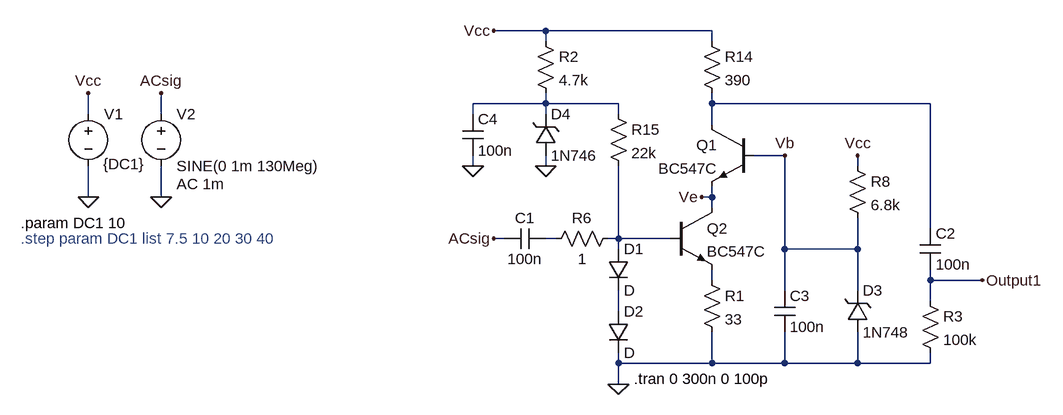
[diagram p0: schematic Cascode.asc]
Cascode.asc, the LTspice schematic file:
Version 4
SHEET 1 1248 680
WIRE -608 -576 -688 -576
WIRE -352 -576 -608 -576
WIRE -608 -560 -608 -576
WIRE -352 -560 -352 -576
WIRE -608 -464 -608 -480
WIRE -608 -464 -720 -464
WIRE -496 -464 -608 -464
WIRE -352 -464 -352 -480
WIRE -16 -464 -352 -464
WIRE -1312 -448 -1312 -480
WIRE -1200 -448 -1200 -480
WIRE -720 -448 -720 -464
WIRE -608 -448 -608 -464
WIRE -496 -448 -496 -464
WIRE -352 -432 -352 -464
WIRE -240 -384 -288 -384
WIRE -720 -368 -720 -384
WIRE -608 -368 -608 -384
WIRE -128 -368 -128 -384
WIRE -1312 -320 -1312 -368
WIRE -1200 -320 -1200 -368
WIRE -352 -320 -352 -336
WIRE -352 -320 -368 -320
WIRE -352 -304 -352 -320
WIRE -16 -272 -16 -464
WIRE -672 -256 -688 -256
WIRE -592 -256 -608 -256
WIRE -496 -256 -496 -368
WIRE -496 -256 -512 -256
WIRE -416 -256 -496 -256
WIRE -496 -240 -496 -256
WIRE -240 -240 -240 -384
WIRE -128 -240 -128 -288
WIRE -128 -240 -240 -240
WIRE -352 -192 -352 -208
WIRE -16 -192 -16 -208
WIRE 64 -192 -16 -192
WIRE -240 -176 -240 -240
WIRE -128 -176 -128 -240
WIRE -16 -160 -16 -192
WIRE -496 -144 -496 -176
WIRE -496 -64 -496 -80
WIRE -352 -64 -352 -112
WIRE -352 -64 -496 -64
WIRE -240 -64 -240 -112
WIRE -240 -64 -352 -64
WIRE -128 -64 -128 -112
WIRE -128 -64 -240 -64
WIRE -16 -64 -16 -80
WIRE -16 -64 -128 -64
WIRE -496 -32 -496 -64
FLAG -1312 -320 0
FLAG -1312 -480 Vcc
FLAG -1200 -320 0
FLAG -688 -576 Vcc
FLAG -1200 -480 ACsig
FLAG -688 -256 ACsig
FLAG 64 -192 Output1
FLAG -128 -384 Vcc
FLAG -496 -32 0
FLAG -240 -384 Vb
FLAG -368 -320 Ve
FLAG -608 -368 0
FLAG -720 -368 0
SYMBOL voltage -1312 -464 R0
WINDOW 3 23 93 Left 2
WINDOW 123 0 0 Left 2
WINDOW 39 -29 126 VLeft 2
SYMATTR Value {DC1}
SYMATTR InstName V1
SYMBOL voltage -1200 -464 R0
WINDOW 123 24 124 Left 2
WINDOW 39 0 0 Left 2
SYMATTR Value2 AC 1m
SYMATTR InstName V2
SYMATTR Value SINE(0 1m 130Meg)
SYMBOL npn -288 -432 M0
SYMATTR InstName Q1
SYMATTR Value BC547C
SYMBOL cap -608 -272 R90
WINDOW 0 0 32 VBottom 2
WINDOW 3 32 32 VTop 2
SYMATTR InstName C1
SYMATTR Value 100n
SYMBOL res -496 -272 R90
WINDOW 0 0 56 VBottom 2
WINDOW 3 32 56 VTop 2
SYMATTR InstName R6
SYMATTR Value 1
SYMBOL res -144 -384 R0
SYMATTR InstName R8
SYMATTR Value 6.8k
SYMBOL cap -256 -176 R0
SYMATTR InstName C3
SYMATTR Value 100n
SYMBOL res -368 -576 R0
SYMATTR InstName R14
SYMATTR Value 390
SYMBOL res -512 -464 R0
SYMATTR InstName R15
SYMATTR Value 22k
SYMBOL npn -416 -304 R0
SYMATTR InstName Q2
SYMATTR Value BC547C
SYMBOL res -368 -208 R0
SYMATTR InstName R1
SYMATTR Value 33
SYMBOL cap -32 -272 R0
SYMATTR InstName C2
SYMATTR Value 100n
SYMBOL res -32 -176 R0
SYMATTR InstName R3
SYMATTR Value 100k
SYMBOL zener -144 -112 M180
WINDOW 0 24 64 Left 2
WINDOW 3 24 0 Left 2
SYMATTR InstName D3
SYMATTR Value 1N748
SYMATTR Description Diode
SYMATTR Type diode
SYMBOL zener -624 -384 M180
WINDOW 0 24 64 Left 2
WINDOW 3 24 0 Left 2
SYMATTR InstName D4
SYMATTR Value 1N746
SYMATTR Description Diode
SYMATTR Type diode
SYMBOL res -624 -576 R0
SYMATTR InstName R2
SYMATTR Value 4.7k
SYMBOL cap -736 -448 R0
SYMATTR InstName C4
SYMATTR Value 100n
SYMBOL diode -512 -240 R0
SYMATTR InstName D1
SYMBOL diode -512 -144 R0
SYMATTR InstName D2
TEXT -472 -40 Left 2 !.tran 0 300n 0 100p
TEXT -1416 -256 Left 2 ;.step param DC1 list 7.5 10 20 30 40
TEXT -1416 -280 Left 2 !.param DC1 10

The netlist it stands for:
* Cascode.asc
V1 Vcc 0 {DC1}
V2 ACsig 0 SINE(0 1m 130Meg) AC 1m
Q1 N002 Vb Ve 0 BC547C
C1 N003 ACsig 100n
R6 N004 N003 1
R8 Vcc Vb 6.8k
C3 Vb 0 100n
R14 Vcc N002 390
R15 N001 N004 22k
Q2 Ve N004 N005 0 BC547C
R1 N005 0 33
C2 N002 Output1 100n
R3 Output1 0 100k
D3 0 Vb 1N748
D4 0 N001 1N746
R2 Vcc N001 4.7k
C4 N001 0 100n
D1 N004 N006 D
D2 N006 0 D
.model D D
.lib standard.dio
.model NPN NPN
.model PNP PNP
.lib standard.bjt
.tran 0 300n 0 100p
* .step param DC1 list 7.5 10 20 30 40
.param DC1 10
.backanno
.end